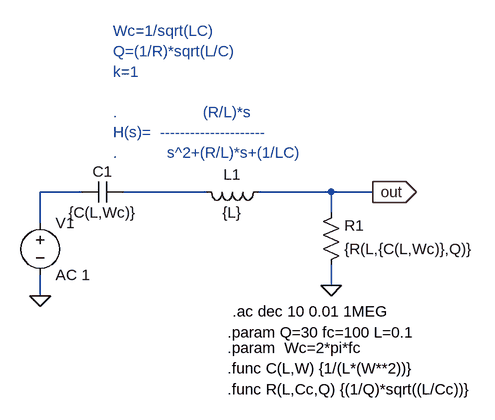
[diagram p0: schematic pasabanda.asc]
pasabanda.asc, the LTspice schematic file:
Version 4
SHEET 1 880 680
WIRE -144 128 -208 128
WIRE 48 128 -80 128
WIRE 240 128 128 128
WIRE 304 128 240 128
WIRE 240 160 240 128
WIRE -208 176 -208 128
WIRE 240 272 240 240
WIRE -208 288 -208 256
FLAG 240 272 0
FLAG -208 288 0
FLAG 304 128 out
IOPIN 304 128 Out
SYMBOL res 224 256 M180
WINDOW 0 36 76 Left 2
WINDOW 3 36 40 Left 2
SYMATTR InstName R1
SYMATTR Value {R(L,{C(L,Wc)},Q)}
SYMBOL ind 144 112 R90
WINDOW 0 5 56 VBottom 2
WINDOW 3 32 56 VTop 2
SYMATTR InstName L1
SYMATTR Value {L}
SYMBOL cap -80 144 M270
WINDOW 0 32 32 VTop 2
WINDOW 3 0 32 VBottom 2
SYMATTR InstName C1
SYMATTR Value {C(L,Wc)}
SYMBOL voltage -208 160 R0
WINDOW 123 0 0 Left 0
WINDOW 39 0 0 Left 0
SYMATTR InstName V1
SYMATTR Value AC 1
TEXT 80 344 Left 2 !.param Q=30 fc=100 L=0.1
TEXT 80 368 Left 2 !.param  Wc=2*pi*fc
TEXT 80 400 Left 2 !.func C(L,W) {1/(L*(W**2))}
TEXT -96 -120 Left 2 ;Wc=1/sqrt(LC)\nQ=(1/R)*sqrt(L/C)\nk=1\n \n.                   (R/L)*s\nH(s)=  ---------------------\n.           s^2+(R/L)*s+(1/LC)
TEXT 80 432 Left 2 !.func R(L,Cc,Q) {(1/Q)*sqrt((L/Cc))}
TEXT 88 312 Left 2 !.ac dec 10 0.01 1MEG

The netlist it stands for:
* pasabanda.asc
R1 0 out {R(L,{C(L,Wc)},Q)}
L1 out N002 {L}
C1 N002 N001 {C(L,Wc)}
V1 N001 0 AC 1
.param Q=30 fc=100 L=0.1
.param  Wc=2*pi*fc
.func C(L,W) {1/(L*(W**2))}
* Wc=1/sqrt(LC)
* Q=(1/R)*sqrt(L/C)
* k=1
* .                   (R/L)*s
* H(s)=  ---------------------
* .           s^2+(R/L)*s+(1/LC)
.func R(L,Cc,Q) {(1/Q)*sqrt((L/Cc))}
.ac dec 10 0.01 1MEG
.backanno
.end